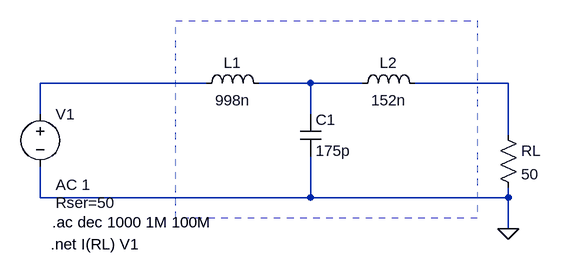
[diagram p0: schematic sim2.asc]
sim2.asc, the LTspice schematic file:
Version 4
SHEET 1 880 680
WIRE -144 144 -400 144
WIRE 16 144 -64 144
WIRE 96 144 16 144
WIRE 320 144 176 144
WIRE -400 192 -400 144
WIRE 16 192 16 144
WIRE 320 224 320 144
WIRE -400 320 -400 272
WIRE 16 320 16 256
WIRE 16 320 -400 320
WIRE 320 320 320 304
WIRE 320 320 16 320
WIRE 320 368 320 320
FLAG 320 368 0
SYMBOL res 304 208 R0
SYMATTR InstName RL
SYMATTR Value 50
SYMBOL voltage -400 176 R0
WINDOW 123 24 124 Left 2
WINDOW 39 24 152 Left 2
SYMATTR InstName V1
SYMATTR Value ""
SYMATTR Value2 AC 1
SYMATTR SpiceLine Rser=50
SYMBOL ind -160 160 R270
WINDOW 0 32 56 VTop 2
WINDOW 3 5 56 VBottom 2
SYMATTR InstName L1
SYMATTR Value 998n
SYMBOL cap 0 192 R0
SYMATTR InstName C1
SYMATTR Value 175p
SYMBOL ind 80 160 R270
WINDOW 0 32 56 VTop 2
WINDOW 3 5 56 VBottom 2
SYMATTR InstName L2
SYMATTR Value 152n
TEXT -382 358 Left 2 !.ac dec 1000 1M 100M
TEXT -384 392 Left 2 !.net I(RL) V1
RECTANGLE Normal 272 352 -192 48 2

The netlist it stands for:
* sim2.asc
RL N003 0 50
V1 N001 0 AC 1 Rser=50
L1 N001 N002 998n
C1 N002 0 175p
L2 N002 N003 152n
.ac dec 1000 1M 100M
.net I(RL) V1
.backanno
.end